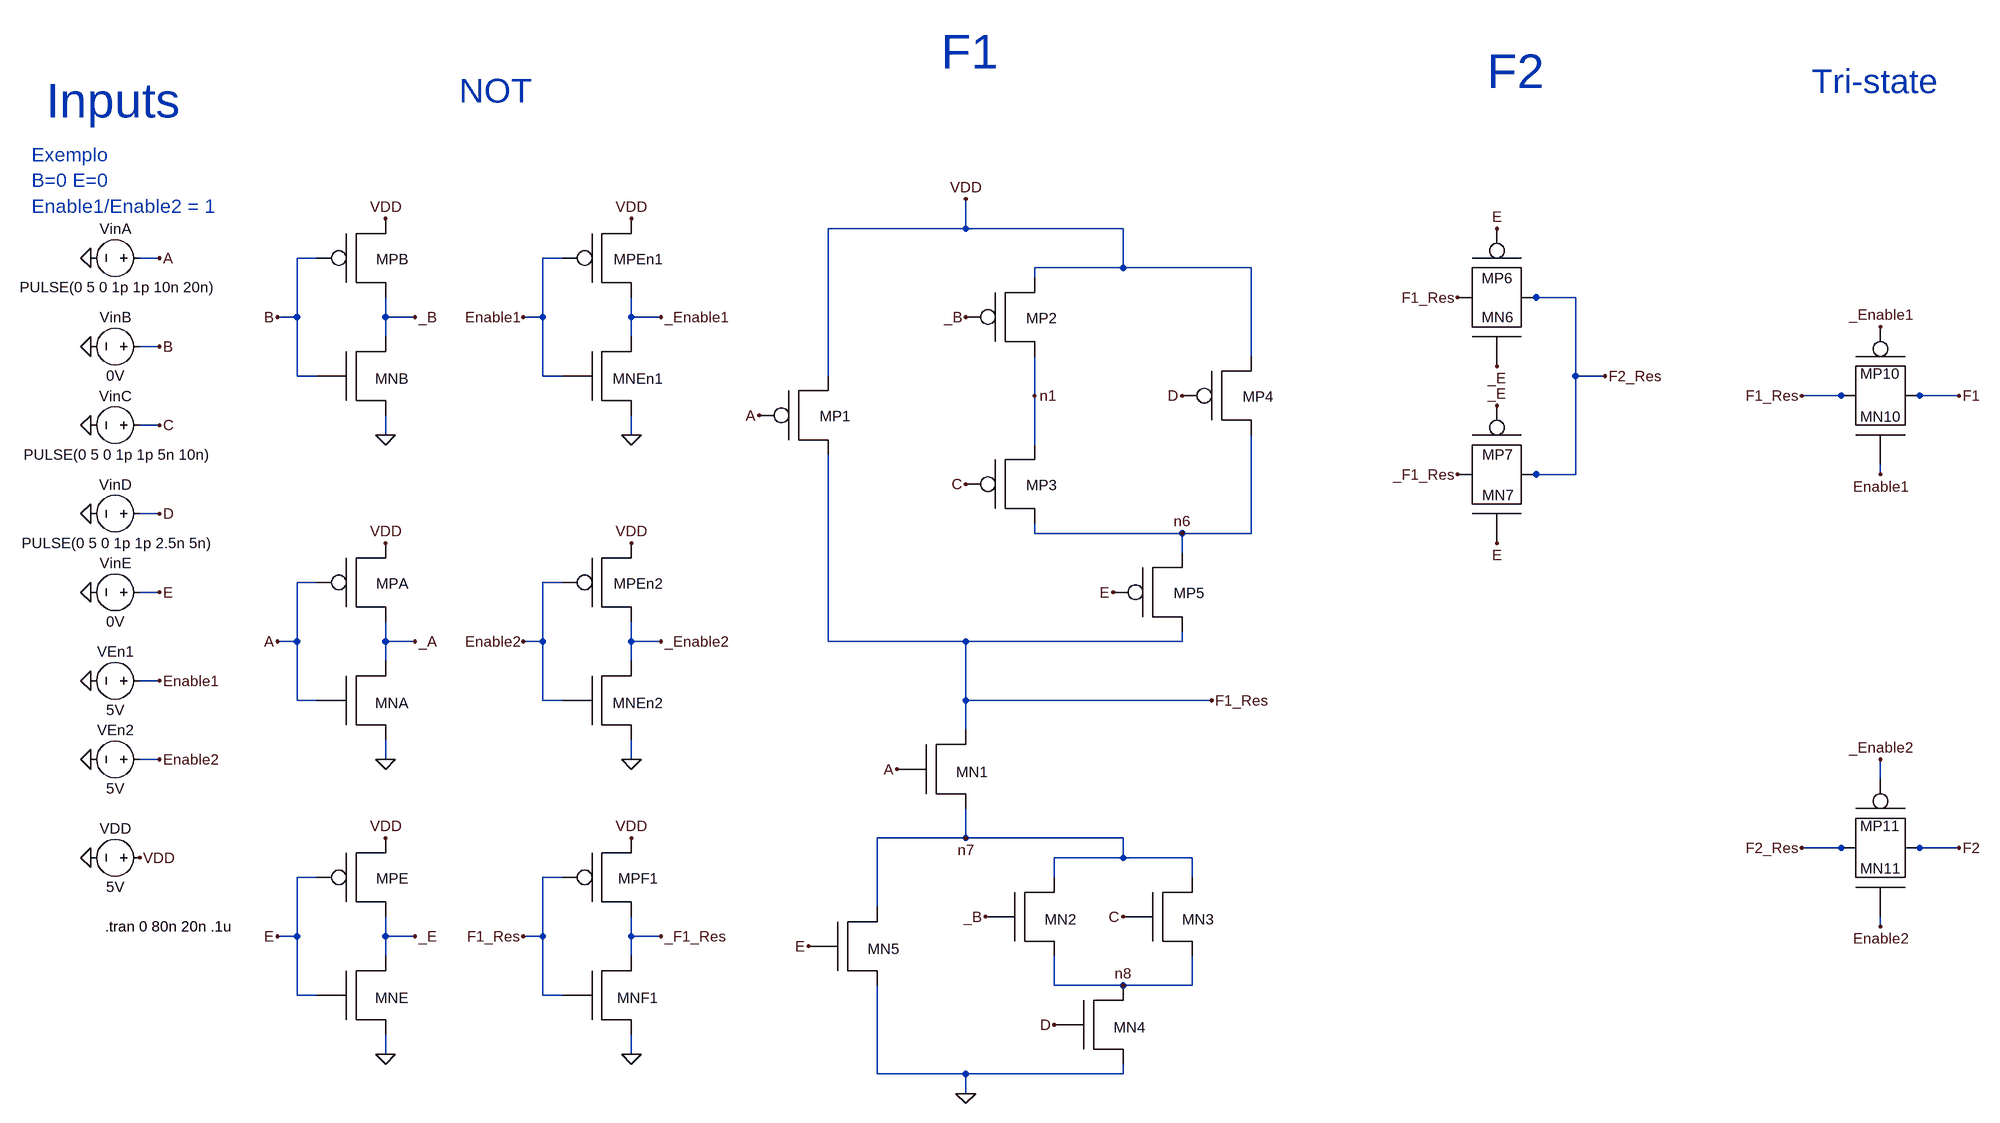
[diagram p0: schematic TPLH_TPHL.asc]
TPLH_TPHL.asc, the LTspice schematic file:
Version 4
SHEET 1 3140 2108
WIRE -32 -560 -32 -608
WIRE -32 -560 -256 -560
WIRE 224 -560 -32 -560
WIRE -1344 -512 -1376 -512
WIRE -1088 -512 -1120 -512
WIRE -688 -512 -720 -512
WIRE 224 -496 224 -560
WIRE 224 -496 80 -496
WIRE 432 -496 224 -496
WIRE 80 -480 80 -496
WIRE 896 -448 880 -448
WIRE 960 -448 896 -448
WIRE -1120 -416 -1120 -512
WIRE -1120 -416 -1152 -416
WIRE -976 -416 -976 -448
WIRE -928 -416 -976 -416
WIRE -720 -416 -720 -512
WIRE -720 -416 -752 -416
WIRE -576 -416 -576 -448
WIRE -528 -416 -576 -416
WIRE -976 -384 -976 -416
WIRE -576 -384 -576 -416
WIRE -1344 -368 -1376 -368
WIRE 432 -352 432 -496
WIRE -1120 -320 -1120 -416
WIRE -1088 -320 -1120 -320
WIRE -720 -320 -720 -416
WIRE -688 -320 -720 -320
WIRE -256 -320 -256 -560
WIRE 960 -320 960 -448
WIRE 1008 -320 960 -320
WIRE 80 -288 80 -352
WIRE 1392 -288 1328 -288
WIRE 1584 -288 1520 -288
WIRE -1344 -240 -1376 -240
WIRE -976 -224 -976 -256
WIRE -576 -224 -576 -256
WIRE 80 -208 80 -288
WIRE 896 -160 880 -160
WIRE 960 -160 960 -320
WIRE 960 -160 896 -160
WIRE 1456 -160 1456 -176
WIRE -1344 -96 -1376 -96
WIRE 80 -64 80 -80
WIRE 320 -64 80 -64
WIRE 432 -64 432 -224
WIRE 432 -64 320 -64
WIRE 320 -32 320 -64
WIRE -1088 16 -1120 16
WIRE -688 16 -720 16
WIRE -1344 32 -1376 32
WIRE -1120 112 -1120 16
WIRE -1120 112 -1152 112
WIRE -976 112 -976 80
WIRE -928 112 -976 112
WIRE -720 112 -720 16
WIRE -720 112 -752 112
WIRE -576 112 -576 80
WIRE -528 112 -576 112
WIRE -256 112 -256 -192
WIRE -32 112 -256 112
WIRE 320 112 320 96
WIRE 320 112 -32 112
WIRE -976 144 -976 112
WIRE -576 144 -576 112
WIRE -1344 176 -1376 176
WIRE -1120 208 -1120 112
WIRE -1088 208 -1120 208
WIRE -720 208 -720 112
WIRE -688 208 -720 208
WIRE -32 208 -32 112
WIRE 368 208 -32 208
WIRE -32 256 -32 208
WIRE -1344 304 -1376 304
WIRE -976 304 -976 272
WIRE -576 304 -576 272
WIRE 1456 336 1456 304
WIRE -32 432 -32 384
WIRE -32 432 -176 432
WIRE 224 432 -32 432
WIRE 1392 448 1328 448
WIRE 1584 448 1520 448
WIRE 224 464 224 432
WIRE 224 464 112 464
WIRE 336 464 224 464
WIRE -1088 496 -1120 496
WIRE -688 496 -720 496
WIRE 112 496 112 464
WIRE 336 496 336 464
WIRE -176 544 -176 432
WIRE 1456 576 1456 560
WIRE -1120 592 -1120 496
WIRE -1120 592 -1152 592
WIRE -976 592 -976 560
WIRE -928 592 -976 592
WIRE -720 592 -720 496
WIRE -720 592 -752 592
WIRE -576 592 -576 560
WIRE -528 592 -576 592
WIRE -976 624 -976 592
WIRE -576 624 -576 592
WIRE 112 672 112 624
WIRE 224 672 112 672
WIRE 336 672 336 624
WIRE 336 672 224 672
WIRE -1120 688 -1120 592
WIRE -1088 688 -1120 688
WIRE -720 688 -720 592
WIRE -688 688 -720 688
WIRE -976 784 -976 752
WIRE -576 784 -576 752
WIRE -176 816 -176 672
WIRE -32 816 -176 816
WIRE 224 816 224 800
WIRE 224 816 -32 816
WIRE -32 848 -32 816
FLAG -368 -256 A
FLAG -32 -144 C
FLAG 320 -288 D
FLAG 208 32 E
FLAG -144 320 A
FLAG -288 608 E
FLAG 224 560 C
FLAG 112 736 D
FLAG -32 848 0
FLAG 368 208 F1_Res
FLAG -32 -608 VDD
FLAG -32 -416 _B
FLAG 0 560 _B
FLAG -1152 -416 B
FLAG -928 -416 _B
FLAG -976 -224 0
FLAG -928 112 _A
FLAG -976 304 0
FLAG -1456 464 0
FLAG -1376 464 VDD
FLAG -976 -576 VDD
FLAG -976 -48 VDD
FLAG -1344 -512 A
FLAG 1328 -288 F1_Res
FLAG 1584 -288 F1
FLAG 1456 576 Enable2
FLAG 1328 448 F2_Res
FLAG 1584 448 F2
FLAG 1456 304 _Enable2
FLAG -752 -416 Enable1
FLAG -528 -416 _Enable1
FLAG -576 -224 0
FLAG -752 112 Enable2
FLAG -528 112 _Enable2
FLAG -576 304 0
FLAG -576 -576 VDD
FLAG -576 -48 VDD
FLAG 1456 -160 Enable1
FLAG 1456 -400 _Enable1
FLAG 80 -288 n1
FLAG -1456 -512 0
FLAG -1344 -368 B
FLAG -1456 -368 0
FLAG -1344 -240 C
FLAG -1456 -240 0
FLAG -1344 -96 D
FLAG -1456 -96 0
FLAG -1344 32 E
FLAG -1456 32 0
FLAG -1344 176 Enable1
FLAG -1456 176 0
FLAG -1344 304 Enable2
FLAG -1456 304 0
FLAG -1152 112 A
FLAG 320 -64 n6
FLAG -32 432 n7
FLAG 224 672 n8
FLAG -1152 592 E
FLAG -928 592 _E
FLAG -976 784 0
FLAG -976 432 VDD
FLAG -752 592 F1_Res
FLAG -528 592 _F1_Res
FLAG -576 784 0
FLAG -576 432 VDD
FLAG 1008 -320 F2_Res
FLAG 768 -448 F1_Res
FLAG 768 -160 _F1_Res
FLAG 832 -560 E
FLAG 832 -336 _E
FLAG 832 -272 _E
FLAG 832 -48 E
SYMBOL PMOSX -288 -272 R0
SYMATTR InstName MP1
SYMBOL PMOSX 48 -432 R0
SYMATTR InstName MP2
SYMBOL PMOSX 48 -160 R0
SYMATTR InstName MP3
SYMBOL PMOSX 400 -304 R0
SYMATTR InstName MP4
SYMBOL PMOSX 288 16 R0
SYMATTR InstName MP5
SYMBOL NMOSX -64 304 R0
SYMATTR InstName MN1
SYMBOL NMOSX 80 544 R0
SYMATTR InstName MN2
SYMBOL NMOSX 304 544 R0
SYMATTR InstName MN3
SYMBOL NMOSX 192 720 R0
SYMATTR InstName MN4
SYMBOL NMOSX -208 592 R0
SYMATTR InstName MN5
SYMBOL NMOSX -1008 -336 R0
SYMATTR InstName MNB
SYMBOL PMOSX -1008 -528 R0
SYMATTR InstName MPB
SYMBOL NMOSX -1008 192 R0
SYMATTR InstName MNA
SYMBOL PMOSX -1008 0 R0
SYMATTR InstName MPA
SYMBOL voltage -1360 464 R90
WINDOW 0 -32 56 VBottom 2
WINDOW 3 32 56 VTop 2
WINDOW 123 0 0 Left 0
WINDOW 39 0 0 Left 0
SYMATTR InstName VDD
SYMATTR Value 5V
SYMBOL NMOSX 1440 -256 R270
WINDOW 0 52 15 VTop 2
SYMATTR InstName MP10
SYMBOL PMOSX 1472 -320 R90
WINDOW 0 50 17 VTop 2
SYMATTR InstName MN10
SYMBOL NMOSX 1440 480 R270
WINDOW 0 52 15 VTop 2
SYMATTR InstName MP11
SYMBOL PMOSX 1472 416 R90
WINDOW 0 50 17 VTop 2
SYMATTR InstName MN11
SYMBOL NMOSX -608 -336 R0
SYMATTR InstName MNEn1
SYMBOL PMOSX -608 -528 R0
SYMATTR InstName MPEn1
SYMBOL NMOSX -608 192 R0
SYMATTR InstName MNEn2
SYMBOL PMOSX -608 0 R0
SYMATTR InstName MPEn2
SYMBOL voltage -1360 -512 R90
WINDOW 0 -32 56 VBottom 2
WINDOW 3 32 56 VTop 2
WINDOW 123 0 0 Left 0
WINDOW 39 0 0 Left 0
SYMATTR InstName VinA
SYMATTR Value PULSE(0 5 0 1p 1p 10n 20n)
SYMBOL voltage -1360 -368 R90
WINDOW 0 -32 56 VBottom 2
WINDOW 3 32 56 VTop 2
WINDOW 123 0 0 Left 0
WINDOW 39 0 0 Left 0
SYMATTR InstName VinB
SYMATTR Value 0V
SYMBOL voltage -1360 -240 R90
WINDOW 0 -32 56 VBottom 2
WINDOW 3 32 56 VTop 2
WINDOW 123 0 0 Left 0
WINDOW 39 0 0 Left 0
SYMATTR InstName VinC
SYMATTR Value PULSE(0 5 0 1p 1p 5n 10n)
SYMBOL voltage -1360 -96 R90
WINDOW 0 -32 56 VBottom 2
WINDOW 3 32 56 VTop 2
WINDOW 123 0 0 Left 0
WINDOW 39 0 0 Left 0
SYMATTR InstName VinD
SYMATTR Value PULSE(0 5 0 1p 1p 2.5n 5n)
SYMBOL voltage -1360 32 R90
WINDOW 0 -32 56 VBottom 2
WINDOW 3 32 56 VTop 2
WINDOW 123 0 0 Left 0
WINDOW 39 0 0 Left 0
SYMATTR InstName VinE
SYMATTR Value 0V
SYMBOL voltage -1360 176 R90
WINDOW 0 -32 56 VBottom 2
WINDOW 3 32 56 VTop 2
WINDOW 123 0 0 Left 0
WINDOW 39 0 0 Left 0
SYMATTR InstName VEn1
SYMATTR Value 5V
SYMBOL voltage -1360 304 R90
WINDOW 0 -32 56 VBottom 2
WINDOW 3 32 56 VTop 2
WINDOW 123 0 0 Left 0
WINDOW 39 0 0 Left 0
SYMATTR InstName VEn2
SYMATTR Value 5V
SYMBOL NMOSX -1008 672 R0
SYMATTR InstName MNE
SYMBOL PMOSX -1008 480 R0
SYMATTR InstName MPE
SYMBOL NMOSX -608 672 R0
SYMATTR InstName MNF1
SYMBOL PMOSX -608 480 R0
SYMATTR InstName MPF1
SYMBOL NMOSX 816 -416 R270
WINDOW 0 -16 17 VTop 2
SYMATTR InstName MN6
SYMBOL NMOSX 816 -128 R270
WINDOW 0 -17 18 VTop 2
SYMATTR InstName MN7
SYMBOL PMOSX 848 -480 R90
WINDOW 0 -15 16 VTop 2
SYMATTR InstName MP6
SYMBOL PMOSX 848 -192 R90
WINDOW 0 -16 15 VTop 2
SYMATTR InstName MP7
TEXT -72 -848 Left 6 ;F1
TEXT 816 -816 Left 6 ;F2
TEXT -856 -784 Left 5 ;NOT
TEXT -1528 -768 Left 6 ;Inputs
TEXT -1552 -680 Left 3 ;Exemplo \nB=0 E=0\nEnable1/Enable2 = 1
TEXT -1432 576 Left 2 !.tran 0 80n 20n .1u
TEXT 1344 -800 Left 5 ;Tri-state

The netlist it stands for:
* TPLH_TPHL.asc
XMP1 F1_Res A VDD PMOSX  ; pins D G S
XMP2 n1 _B VDD PMOSX  ; pins D G S
XMP3 n6 C n1 PMOSX  ; pins D G S
XMP4 n6 D VDD PMOSX  ; pins D G S
XMP5 F1_Res E n6 PMOSX  ; pins D G S
XMN1 F1_Res A n7 NMOSX  ; pins D G S
XMN2 n7 _B n8 NMOSX  ; pins D G S
XMN3 n7 C n8 NMOSX  ; pins D G S
XMN4 n8 D 0 NMOSX  ; pins D G S
XMN5 n7 E 0 NMOSX  ; pins D G S
XMNB _B B 0 NMOSX  ; pins D G S
XMPB _B B VDD PMOSX  ; pins D G S
XMNA _A A 0 NMOSX  ; pins D G S
XMPA _A A VDD PMOSX  ; pins D G S
VDD VDD 0 5V
XMP10 F1_Res Enable1 F1 NMOSX  ; pins D G S
XMN10 F1_Res _Enable1 F1 PMOSX  ; pins D G S
XMP11 F2_Res Enable2 F2 NMOSX  ; pins D G S
XMN11 F2_Res _Enable2 F2 PMOSX  ; pins D G S
XMNEn1 _Enable1 Enable1 0 NMOSX  ; pins D G S
XMPEn1 _Enable1 Enable1 VDD PMOSX  ; pins D G S
XMNEn2 _Enable2 Enable2 0 NMOSX  ; pins D G S
XMPEn2 _Enable2 Enable2 VDD PMOSX  ; pins D G S
VinA A 0 PULSE(0 5 0 1p 1p 10n 20n)
VinB B 0 0V
VinC C 0 PULSE(0 5 0 1p 1p 5n 10n)
VinD D 0 PULSE(0 5 0 1p 1p 2.5n 5n)
VinE E 0 0V
VEn1 Enable1 0 5V
VEn2 Enable2 0 5V
XMNE _E E 0 NMOSX  ; pins D G S
XMPE _E E VDD PMOSX  ; pins D G S
XMNF1 _F1_Res F1_Res 0 NMOSX  ; pins D G S
XMPF1 _F1_Res F1_Res VDD PMOSX  ; pins D G S
XMN6 F1_Res _E F2_Res NMOSX  ; pins D G S
XMN7 _F1_Res E F2_Res NMOSX  ; pins D G S
XMP6 F1_Res E F2_Res PMOSX  ; pins D G S
XMP7 _F1_Res _E F2_Res PMOSX  ; pins D G S
* F1
* F2
* NOT
* Inputs
* Exemplo
* B=0 E=0
* Enable1/Enable2 = 1
.tran 0 80n 20n .1u
* Tri-state
.backanno
.end